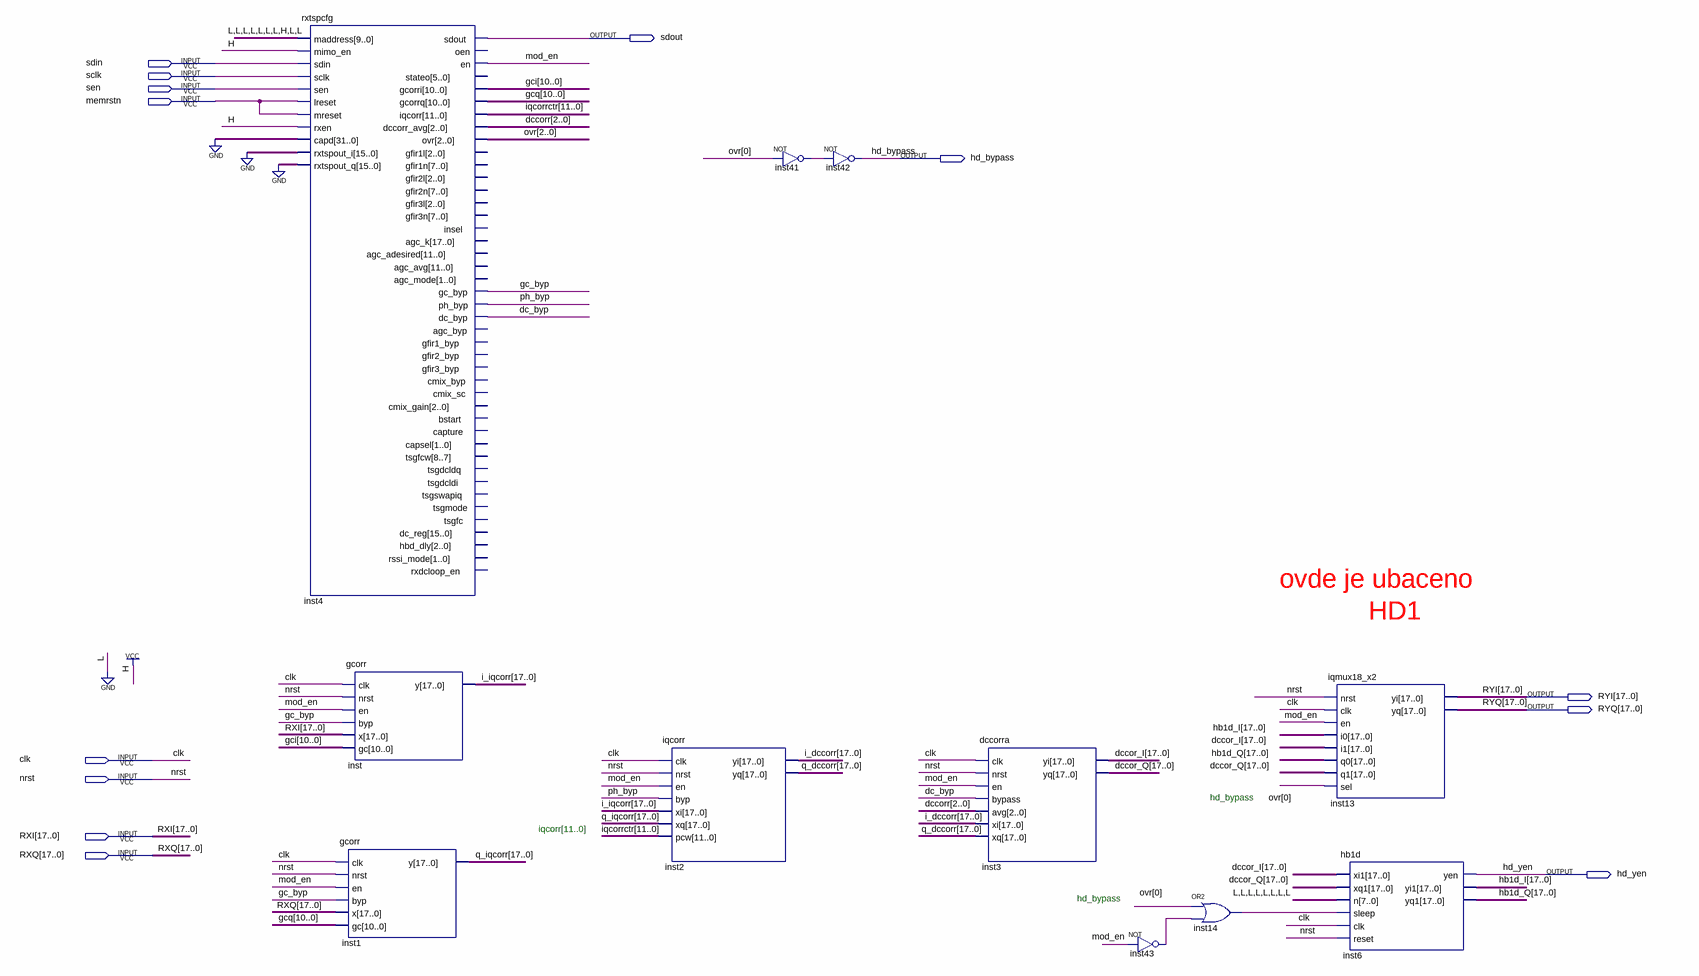
[diagram p0: schematic sheet]
// Quartus schematic rx_chain.bdf as structural Verilog: 11 symbols, 13 pins
module rx_chain (
  input  sdin,
  input  sclk,
  input  sen,
  input  memrstn,
  input  clk,
  input  nrst,
  input  [17:0] RXI,
  input  [17:0] RXQ,
  output sdout,
  output hd_bypass,
  output [17:0] RYI,
  output [17:0] RYQ,
  output hd_yen
);

  wire dc_byp, gc_byp, inst14_out, inst41_out, inst43_out, mod_en, ph_byp;
  wire [2:0] dccorr, ovr;
  wire [10:0] gci, gcq;
  wire [11:0] iqcorrctr;
  wire [17:0] dccor_I, dccor_Q, hb1d_I, hb1d_Q, i_dccorr, i_iqcorr, q_dccorr, q_iqcorr;

  rxtspcfg inst4 (
    .maddress(10'b0000000100), .mimo_en(1'b1), .sdin(sdin), .sclk(sclk), .sen(sen), .lreset(memrstn),
    .mreset(memrstn), .rxen(1'b1), .capd({32{1'b0}}), .rxtspout_i({16{1'b0}}), .rxtspout_q({16{1'b0}}),
    .sdout(sdout), .en(mod_en), .gcorri(gci), .gcorrq(gcq), .iqcorr(iqcorrctr), .dccorr_avg(dccorr),
    .ovr(ovr), .gc_byp(gc_byp), .ph_byp(ph_byp), .dc_byp(dc_byp));  // open: oen, stateo, gfir1l, gfir1n, gfir2l, gfir2n, gfir3l, gfir3n, insel, agc_k, agc_adesired, agc_avg, agc_mode, agc_byp, gfir1_byp, gfir2_byp, gfir3_byp, cmix_byp, cmix_sc, cmix_gain, bstart, capture, capsel, tsgfcw, tsgdcldq, tsgdcldi, tsgswapiq, tsgmode, tsgfc, dc_reg, hbd_dly, rssi_mode, rxdcloop_en
  gcorr inst (.clk(clk), .nrst(nrst), .en(mod_en), .byp(gc_byp), .x(RXI), .gc(gci), .y(i_iqcorr));
  gcorr inst1 (.clk(clk), .nrst(nrst), .en(mod_en), .byp(gc_byp), .x(RXQ), .gc(gcq), .y(q_iqcorr));
  iqcorr inst2 (
    .clk(clk), .nrst(nrst), .en(mod_en), .byp(ph_byp), .xi(i_iqcorr), .xq(q_iqcorr), .pcw(iqcorrctr),
    .yi(i_dccorr), .yq(q_dccorr));
  not inst41 (inst41_out, ovr[0]);
  not inst42 (hd_bypass, inst41_out);
  dccorra inst3 (
    .clk(clk), .nrst(nrst), .en(mod_en), .bypass(dc_byp), .avg(dccorr), .xi(i_dccorr), .xq(q_dccorr),
    .yi(dccor_I), .yq(dccor_Q));
  not inst43 (inst43_out, mod_en);
  or inst14 (inst14_out, ovr[0], inst43_out);
  iqmux18_x2 inst13 (
    .nrst(nrst), .clk(clk), .en(mod_en), .i0(hb1d_I), .i1(dccor_I), .q0(hb1d_Q), .q1(dccor_Q), .sel(ovr[0]),
    .yi(RYI), .yq(RYQ));
  hb1d inst6 (
    .xi1(dccor_I), .xq1(dccor_Q), .n({8{1'b0}}), .sleep(inst14_out), .clk(clk), .reset(nrst), .yen(hd_yen),
    .yi1(hb1d_I), .yq1(hb1d_Q));

  // Notes on the sheet:
  //   ovde je ubaceno
  //   HD1
  //   hd_bypass
  //   iqcorr[11..0]
  //   hd_bypass
endmodule
